# Altium schematic sheet Power-SMPS.SchDoc: Power-SMPS
size Letter; DocumentNumber: 5; SheetNumber: 2; SheetTotal: 12
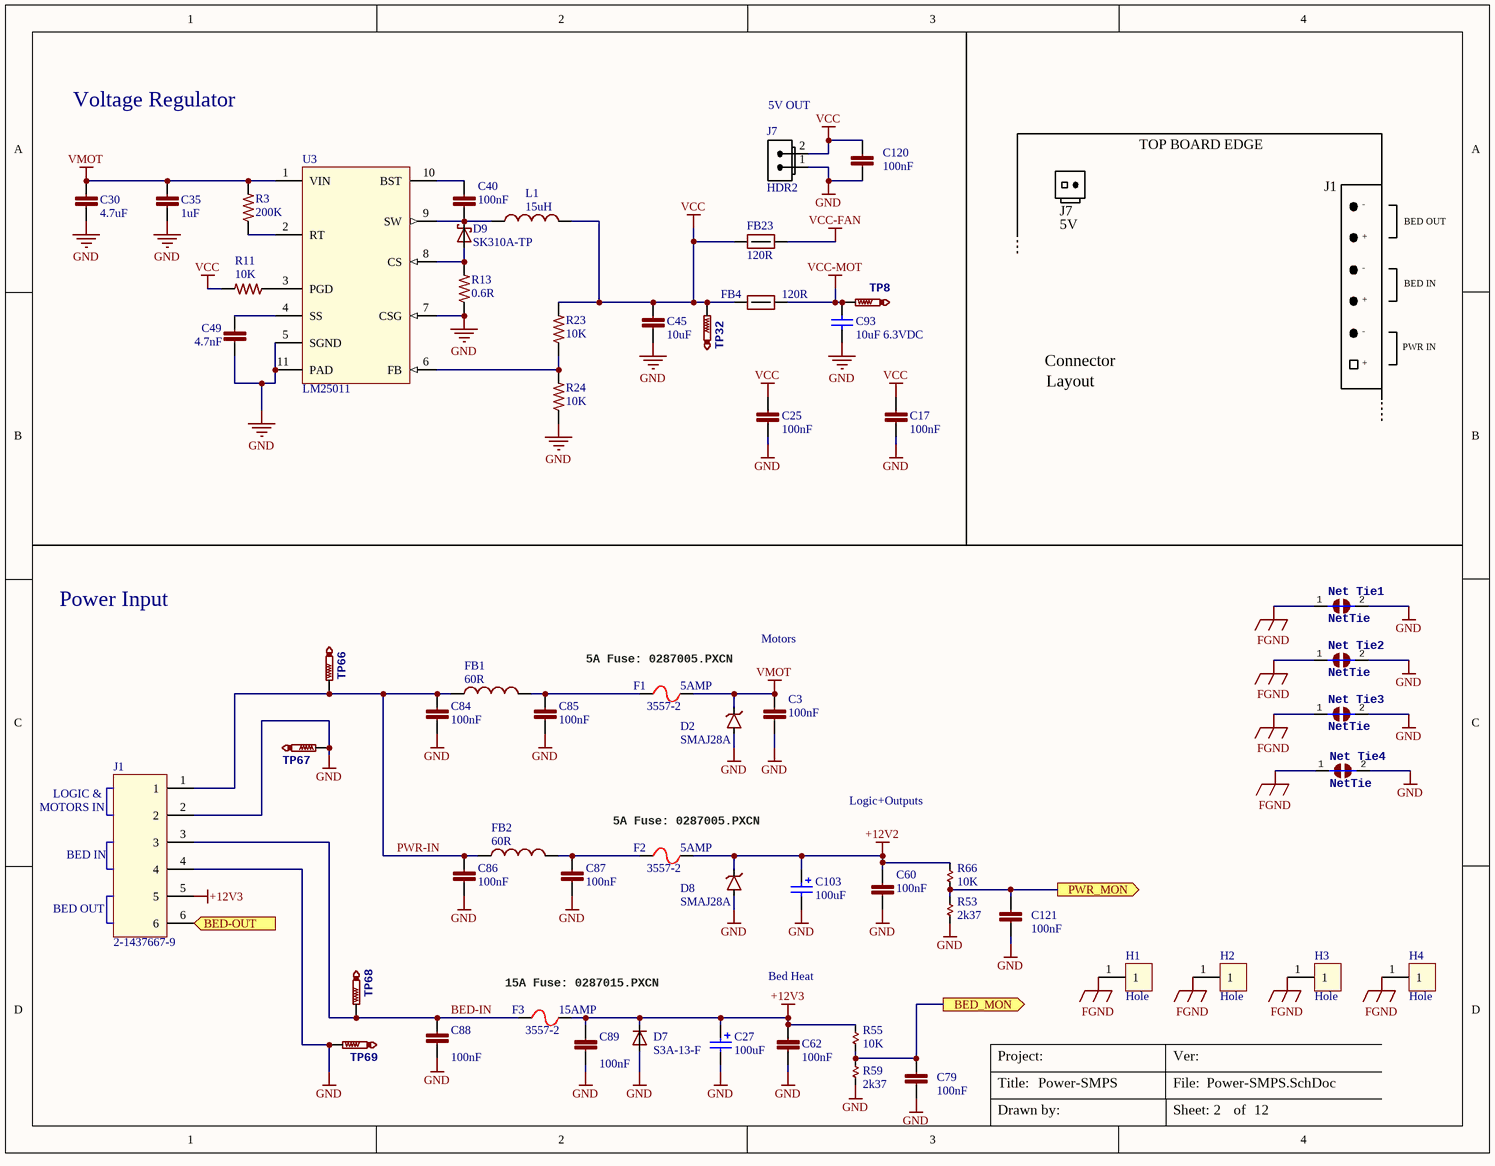
[diagram p0: Power-SMPS.SchDoc]

## Parts
C3  100nF  [C0603]
C17  100nF  [C0402]
C25  100nF  [C0603]
C27  value 100uF  [CAP-ELEC-063063077]  (hidden comment: UWT1V101MCL1GS)
C30  4.7uF  [C1206]
C35  1uF  [C0805]
C40  100nF  [C0603]
C45  10uF  [C0805]
C49  4.7nF  [C0402]
C60  100nF  [C0603]
C62  100nF  [C0603]
C79  100nF  [C0402]
C84  100nF  [C0603]
C85  100nF  [C0603]
C86  100nF  [C0603]
C87  100nF  [C0603]
C88  100nF  [C0603]
C89  100nF  [C0603]
C93  value 10uF 6.3VDC  [C0603]  (hidden comment: 0603)
C103  value 100uF  [CAP-ELEC-063063077]  (hidden comment: UWT1V101MCL1GS)
C120  100nF  [C0402]
C121  100nF  [C0402]
D2  SMAJ28A  [SMA-SM]
D7  S3A-13-F  [DO-214AB]
D8  SMAJ28A  [SMA-SM]
D9  SK310A-TP  [SMA-SM]
F1  3557-2  [3557]
F2  3557-2  [3557]
F3  3557-2  [3557]
FB1  value 60R  [L1806]  (hidden comment: BLM41PG600SN1L)
FB2  value 60R  [L1806]  (hidden comment: BLM41PG600SN1L)
FB4  120R  [FB0603]
FB23  120R  [FB0603]
H1  Hole  [Wave_hole_3x7-singleSided]  (no BOM)
H2  Hole  [Wave_hole_3x7-singleSided]  (no BOM)
H3  Hole  [Wave_hole_3x7-singleSided]  (no BOM)
H4  Hole  [Wave_hole_3x7-singleSided]  (no BOM)
J1  2-1437667-9  [CON-Barrier-6-8.26mm]
J7  value HDR2  [70543-02]  (hidden comment: CONN 2PIN VERT 0.1" SHRD LOCKING)
L1  15uH  [XAL50xx_VLS6045]
Net_Tie1  NetTie  [Net Tie]  (net tie, no BOM)
Net_Tie2  NetTie  [Net Tie]  (net tie, no BOM)
Net_Tie3  NetTie  [Net Tie]  (net tie, no BOM)
Net_Tie4  NetTie  [Net Tie]  (net tie, no BOM)
R3  200K  [R0402]
R11  10K  [R0402]
R13  0.6R  [2512R-0.55]
R23  10K  [R0402]
R24  10K  [R0402]
R53  2k37  [R0402]
R55  10K  [R0402]
R59  2k37  [R0402]
R66  10K  [R0402]
TP8  TestPoint  [TP1-27]  (value not drawn)  (no BOM)
TP32  TestPoint  [TP1-27]  (value not drawn)  (no BOM)
TP66  TestPoint  [TP1-27]  (value not drawn)  (no BOM)
TP67  TestPoint  [TP1-27]  (value not drawn)  (no BOM)
TP68  TestPoint  [TP1-27]  (value not drawn)  (no BOM)
TP69  TestPoint  [TP1-27]  (value not drawn)  (no BOM)
U3  LM25011  [VSSOP10]

## Ports
BED-OUT, BED_MON, PWR_MON

## Nets
+12V2: C60.1 C103.1 D8.K F2.2 R66.2
+12V3: C27.1 C62.1 C89.1 D7.C F3.2 J1.5 R55.2
FGND: H1.1 H2.1 H3.1 H4.1 Net_Tie1.1 Net_Tie2.1 Net_Tie3.1 Net_Tie4.1
GND: C3.2 C17.2 C25.2 C27.2 C30.2 C35.2 C45.2 C49.2 C60.2 C62.2 C79.2 C84.2 C85.2 C86.2 C87.2 C88.2 C89.2 C93.1 C103.2 C120.1 C121.2 D2.A D7.A D8.A J1.2 J1.4 J7.1(S) Net_Tie1.2 Net_Tie2.2 Net_Tie3.2 Net_Tie4.2 R13.1 R24.1 R53.2 R59.2 TP67.TP TP69.TP U3.5(SGND) U3.7(CSG) U3.11(PAD)
VCC: C17.1 C25.1 C45.1 C120.2 FB4.1 FB23.1 J7.2(S) L1.2 R11.2 R23.2 TP32.TP
VCC-FAN: FB23.2
VCC-MOT: C93.2 FB4.2 TP8.TP
VMOT: C3.1 C30.1 C35.1 D2.K F1.2 R3.2 U3.1(VIN)
BED-IN: C88.1 F3.1 J1.3 TP68.TP
BED-OUT: J1.6 ; port BED-OUT
BED_MON: C79.1 R55.1 R59.1 ; port BED_MON
PWR-IN: C84.1 C86.1 FB1.1 FB2.1 J1.1 TP66.TP
PWR_MON: C121.1 R53.1 R66.1 ; port PWR_MON
NetC40_1: C40.1 U3.10(BST)
NetC40_2: C40.2 D9.C L1.1 U3.9(SW)
NetC49_1: C49.1 U3.4(SS)
NetC85_1: C85.1 F1.1 FB1.2
NetC87_1: C87.1 F2.1 FB2.2
NetD9_A: D9.A R13.2 U3.8(CS)
NetR3_1: R3.1 U3.2(RT)
NetR11_1: R11.1 U3.3(PGD)
NetR23_1: R23.1 R24.2 U3.6(FB)

## Notes on the sheet
- Voltage Regulator
- (near J7) 5V OUT
- TOP BOARD EDGE
- J7
- 5V
- J1
- -
- BED OUT
- +
- BED IN
- Connector
- PWR IN
- Layout
- Power Input
- Motors
- (near F1) 5A Fuse: 0287005.PXCN
- (near F1) 5AMP
- MOTORS IN
- LOGIC &
- (near F2) 5A Fuse: 0287005.PXCN
- Logic+Outputs
- (near F2) 5AMP
- (near F3) 15A Fuse: 0287015.PXCN
- (near F3) 15AMP
- Bed Heat
- Title:
- Project:
- File:
- Ver:
- Drawn by:
- Sheet:
- of

## Library data of the parts
C3 C25 C40 C60 C62 C84-C89 = C0603C104K5RACTU: CAP CER 0603 100nF 50V 10% X7R; Manufacturer: Kemet; Part Description: 0.1µF ±10% 50V Ceramic Capacitor X7R 0603 (1608 Metric); EE_SPEC: 100nF 50V X7R 0603; Tolerance: +/- 10%; VALUE: 100nF; MANUFACTURER #: C0603C104K5RACTU; DISTRIBUTOR #: 399-5089-2-ND; DISTRIBUTOR: Digi-Key; PART: 100nF
C17 C79 C121 = GRM155R71C104KA88D: CAP CER 0402 100nF 16V 10% X7R; Manufacturer: Murata; Part Description: 0.10µF ±10% 16V Ceramic Capacitor X7R 0402 (1005 Metric); EE_SPEC: 100nF 16V X7R 0402; Tolerance: +/- 10%; VALUE: 100nF; MANUFACTURER #: GRM155R71C104KA88D; DISTRIBUTOR #: 490-3261-2-ND; DISTRIBUTOR: Digi-Key; PART: 100nF
C27 C103 = UWT1V101MCL1GS: CAP ALUM 100UF 35V 20% SMD; Manufacturer: Nichicon; Part Description: 100µF 35V Aluminum Capacitors Radial, Can - SMD 1000 Hrs @ 105°C; EE_SPEC: 100uF 35V Al-El; Tolerance: +/- 20%; MANUFACTURER #: UWT1V101MCL1GS; DISTRIBUTOR #: 493-2203-2-ND; DISTRIBUTOR: Digi-Key; PART: 100uF
C30 = C1206C475K5PACTU: CAP CER 1206 4.7uF 50V 10% X5R; Manufacturer: Kemet; Part Description: 4.7µF ±10% 50V Ceramic Capacitor X5R 1206 (3216 Metric); EE_SPEC: 4.7uF 50V X5R 1206; Tolerance: +/- 10%; VALUE: 4.7uF; MANUFACTURER #: C1206C475K5PACTU; DISTRIBUTOR #: 399-5507-2-ND; DISTRIBUTOR: Digi-Key; PART: 4.7uF
C35 = GRM21BR71H105KA12L: CAP CER 0805 1uF 50V 10% X7R; Manufacturer: Murata; Part Description: 1µF ±10% 50V Ceramic Capacitor X7R 0805 (2012 Metric); EE_SPEC: 1uF 50V X7R 0805; Tolerance: +/- 10%; VALUE: 1uF; MANUFACTURER #: GRM21BR71H105KA12L; DISTRIBUTOR #: 490-4736-2-ND; DISTRIBUTOR: Digi-Key; PART: 1uF
C45 = C0805C106K8PACTU: CAP CER 0805 10uF 10V 10% X5R; Manufacturer: Kemet; Part Description: 10µF ±10% 10V Ceramic Capacitor X5R 0805 (2012 Metric); EE_SPEC: 10uF 10V X5R 0805; Tolerance: +/- 10%; VALUE: 10uF; MANUFACTURER #: C0805C106K8PACTU; DISTRIBUTOR #: 399-4925-2-ND; DISTRIBUTOR: Digi-Key; PART: 10uF
C49 = CC0402KRX7R8BB472: CAP CER 0402 4.7nF 25V 10% X7R; Manufacturer: YAGEO; Part Description: 4700pF ±10% 25V Ceramic Capacitor X7R 0402 (1005 Metric); EE_SPEC: 4.7nF 25V X7R 0402; Tolerance: +/- 10%; VALUE: 4.7nF; MANUFACTURER #: CC0402KRX7R8BB472; DISTRIBUTOR #: 311-1039-2-ND; DISTRIBUTOR: Digi-Key; PART: 4.7nF
C93 = C1608JB0J106K080AB: CAP CER 10UF 6.3V 10% JB 0603; Manufacturer: TDK; Tolerance: +/- 10%; EE_SPEC: 6.3VDC; Part Description: CAP CER 10UF 6.3V 10% JB 0603; MANUFACTURER #: C1608JB0J106K080AB; DISTRIBUTOR #: 445-11185-1-ND; DISTRIBUTOR: Digi-Key; PART: 10uF 6.3VDC
C120 = GRM155R71C104KA88D: CAP CER 0402 100nF 16V 10% X7R; MANUFACTURER: Murata; PART DESCRIPTION: 0.10µF ±10% 16V Ceramic Capacitor X7R 0402 (1005 Metric); TOLERANCE: +/- 10%; EE_SPEC: 100nF 16V X7R 0402; VALUE: 100nF; MANUFACTURER #: GRM155R71C104KA88D; DISTRIBUTOR #: 490-3261-2-ND; DISTRIBUTOR: Digi-Key; PART: 100nF
D2 D8 = SMAJ28A: TVS DIODE 28VWM 45.4VC SMA; Manufacturer: Diodes Inc; MANUFACTURER #: SMAJ28A-13-F; EE_SPEC: 28Vrs 45.4Vc; Tolerance: NA; DISTRIBUTOR #: SMAJ28A-FDITR-ND; DISTRIBUTOR: Digi-Key; PART: SMAJ28A; Part Description: TVS DIODE 28VWM 45.4VC SMA; VALUE: SMAJ28A
D7 = S3A-13-F: DIODE DO-214AB; Manufacturer: Diodes Incorporated; Part Description: Diode Standard 50V 3A Surface Mount SMC; EE_SPEC: 50V 3A 1.15Vf; Tolerance: NA; Value: S3A-13-F; DISTRIBUTOR #: S3A-FDITR-ND; DISTRIBUTOR: Digi-Key; MANUFACTURER #: S3A-13-F; PART: S3A-13-F
D9 = SK310A: DIODE Schottky 3A SMA; Manufacturer: MCC; MANUFACTURER #: SK310A-LTP; Part Description: Diode Schottky 100V 3A Surface Mount DO-214AC (SMA); EE_SPEC: 3A 100V; Tolerance: NA; VALUE: SK310A; DISTRIBUTOR #: SK310A-LTPMSTR-ND; DISTRIBUTOR: Digi-Key; PART: SK310A
F1-F3 = 3557-2: FUSE PTH ATO; Manufacturer: Keystone; Part Description: FUSE BLOCK BLADE 500V 30A PCB; EE_SPEC: ATC 500V 30A; Tolerance: NA; MANUFACTURER #: 3557-2; DISTRIBUTOR #: 36-3557-2-ND; DISTRIBUTOR: Digi-Key; PART: Fuse; VALUE: Fuse
FB1 FB2 = BLM41PG600SN1L: FERRITE BEAD 1806 60ohm; Manufacturer: Murata; PART: 60Rf; Part Description: FERRITE BEAD 60 OHM 1806 1LN; EE_SPEC: 60R 6A 0.009Ohm; Tolerance: NA; MANUFACTURER #: BLM41PG600SN1L; DISTRIBUTOR #: 490-1058-2-ND; DISTRIBUTOR: Digi-Key
FB4 FB23 = FERRITE 120R 3A 0603: FERRITE BEAD 120 OHM 0603 1LN; MANUFACTURER: Samsung; MANUFACTURER #: CIS10P121AC; VALUE: 120Rfb; TOLERANCE: -NA-; EE_SPEC: 3A; DISTRIBUTOR #: 1276-6351-2-ND; PART: FERRITE 120R 3A 0603; PART DESCRIPTION: FERRITE BEAD 120 OHM 0603 1LN
  FB4: DISTRIBUTOR: DigiKey
  FB23: DISTRIBUTOR: Digikey
J1 = 2-1437667-9: CONN BARRIER STRIP 6CIRC 0.325"; MANUFACTURER #: 4DB-P108-06; Manufacturer: TE; PART: 6POS; Part Description: 6 Circuit 0.325" (8.26mm) Barrier Block Connector, Screws with Captive Plate; EE_SPEC: 150V 2A; Tolerance: NA; VALUE: 6POS; DISTRIBUTOR #: A98476-ND; DISTRIBUTOR: Digi-Key
J7 = CONN 2PIN VERT 0.1" SHRD LOCKING: Connector 2pos; MANUFACTURER: Molex; MANUFACTURER #: 0705430001; PART: 10 Pin Conn; PART DESCRIPTION: 2 Positions Header, Shrouded Connector 0.100" (2.54mm) Through Hole Gold; TOLERANCE: -NA-; DISTRIBUTOR #: WM4800-ND; DISTRIBUTOR: Digi-Key; EE_SPEC: -NA-
L1 = IND 15uH 2.5A 0.075R: FIXED IND 15UH 2.5A 98 MOHM SMD; Manufacturer: TDK; MANUFACTURER #: VLS6045EX-150M; Part Description: 15µH Shielded Wirewound Inductor 2.5A 98 mOhm Max Nonstandard; EE_SPEC: 15uH 2.5A 0.098-Ohm; Tolerance: +/- 20%; ManufacturerPartNumber2: XAL5050-153MEB; Value: 15uH; Manufacturer2: Coilcraft; DISTRIBUTOR #: 445-173041-2-ND; DISTRIBUTOR: Digi-Key; PART: 15uH
Net_Tie1-Net_Tie4 = NetTie: Net Tie; LastRevisionNote: ImportComponents; Published: 23-Apr-2014; Publisher: UltiMachine; LastRevisionDate: 23-Apr-2014
R3 = CRCW0402200KFKED: RES 0402 200K; Manufacturer: Vishay Dale; Part Description: 200k Ohm ±1% 0.063W, 1/16W Chip Resistor 0402 (1005 Metric) Automotive AEC-Q200 Thick Film; EE_SPEC: 200k 1% 0402; Tolerance: +/- 1%; VALUE: 200K; MANUFACTURER #: CRCW0402200KFKED; DISTRIBUTOR #: 541-200KLTR-ND; DISTRIBUTOR: Digi-Key; PART: 200K
R11 R23 R24 = RC0402FR-0710KP: RES SMD 10K OHM 1% 1/16W 0402; MANUFACTURER: Yageo; PART: 10k 1% 0402; PART DESCRIPTION: 10k Ohm ±1% 0.063W, 1/16W Chip Resistor 0402 (1005 Metric) Moisture Resistant Thick Film; EE_SPEC: 10k 1% 0402 1/16W; VALUE: 10K; MANUFACTURER #: RC0402FR-0710KP; DISTRIBUTOR #: YAG1249TR-ND; DISTRIBUTOR: Digi-Key; TOLERANCE: 1%
R13 = RL2512FK-070R06L: RES 0.06 OHM 1W 1% 2512 SMD; Manufacturer: Yageo; Part Description: 0.06 Ohm ±1% 1W Chip Resistor 2512 (6432 Metric) Automotive AEC-Q200, Current Sense, Moisture Resistant Thick Film; EE_SPEC: 0.06R 1% 2512; VALUE: 0.6R; MANUFACTURER #: RL2512FK-070R06L; DISTRIBUTOR #: 311-0.06TTR-ND; DISTRIBUTOR: Digi-Key; PART: 0.6R; Tolerance: 1%
R53 R59 = RC0402FR-072K37L: RES SMD 2.37K OHM 1% 1/16W 0402; Manufacturer: Yageo; Part Description: 2.37k Ohm ±1% 0.063W, 1/16W Chip Resistor 0402 (1005 Metric) Moisture Resistant Thick Film; EE_SPEC: 2.37k 1% 0402; Tolerance: +/- 1%; VALUE: 2k37; MANUFACTURER #: RC0402FR-072K37L; DISTRIBUTOR #: 311-2.37KLRTR-ND; DISTRIBUTOR: Digi-Key; PART: 2.37k
R55 R66 = 10k 1% 0402: RES SMD 10K OHM 1% 1/16W 0402; MANUFACTURER: Yageo; MANUFACTURER #: RC0402FR-0710KP; PART DESCRIPTION: 10k Ohm ±1% 0.063W, 1/16W Chip Resistor 0402 (1005 Metric) Moisture Resistant Thick Film; EE_SPEC: 10k 1% 0402 1/16W; DISTRIBUTOR #: YAG1249TR-ND; DISTRIBUTOR: Digi-key; PART: 10k 1% 0402; TOLERANCE: 1%; VALUE: 10K
TP8 TP32 TP66-TP69 = TestPoint: Test Point
U3 = LM25011: REG BUCK; MANUFACTURER #: LM25011MY/NOPB; Manufacturer: TI; Part Description: Buck Switching Regulator IC Positive Adjustable 2.51V 1 Output 2A 10-TFSOP, 10-MSOP (0.118", 3.00mm Width) Exposed Pad; EE_SPEC: 42Vmax 2A 2MHz; Tolerance: NA; Value: LM25011; DISTRIBUTOR #: LM25011MY/NOPBTR-ND; DISTRIBUTOR: Digi-Key; PART: LM25011